# Altium project PCB_Project.PrjPcb
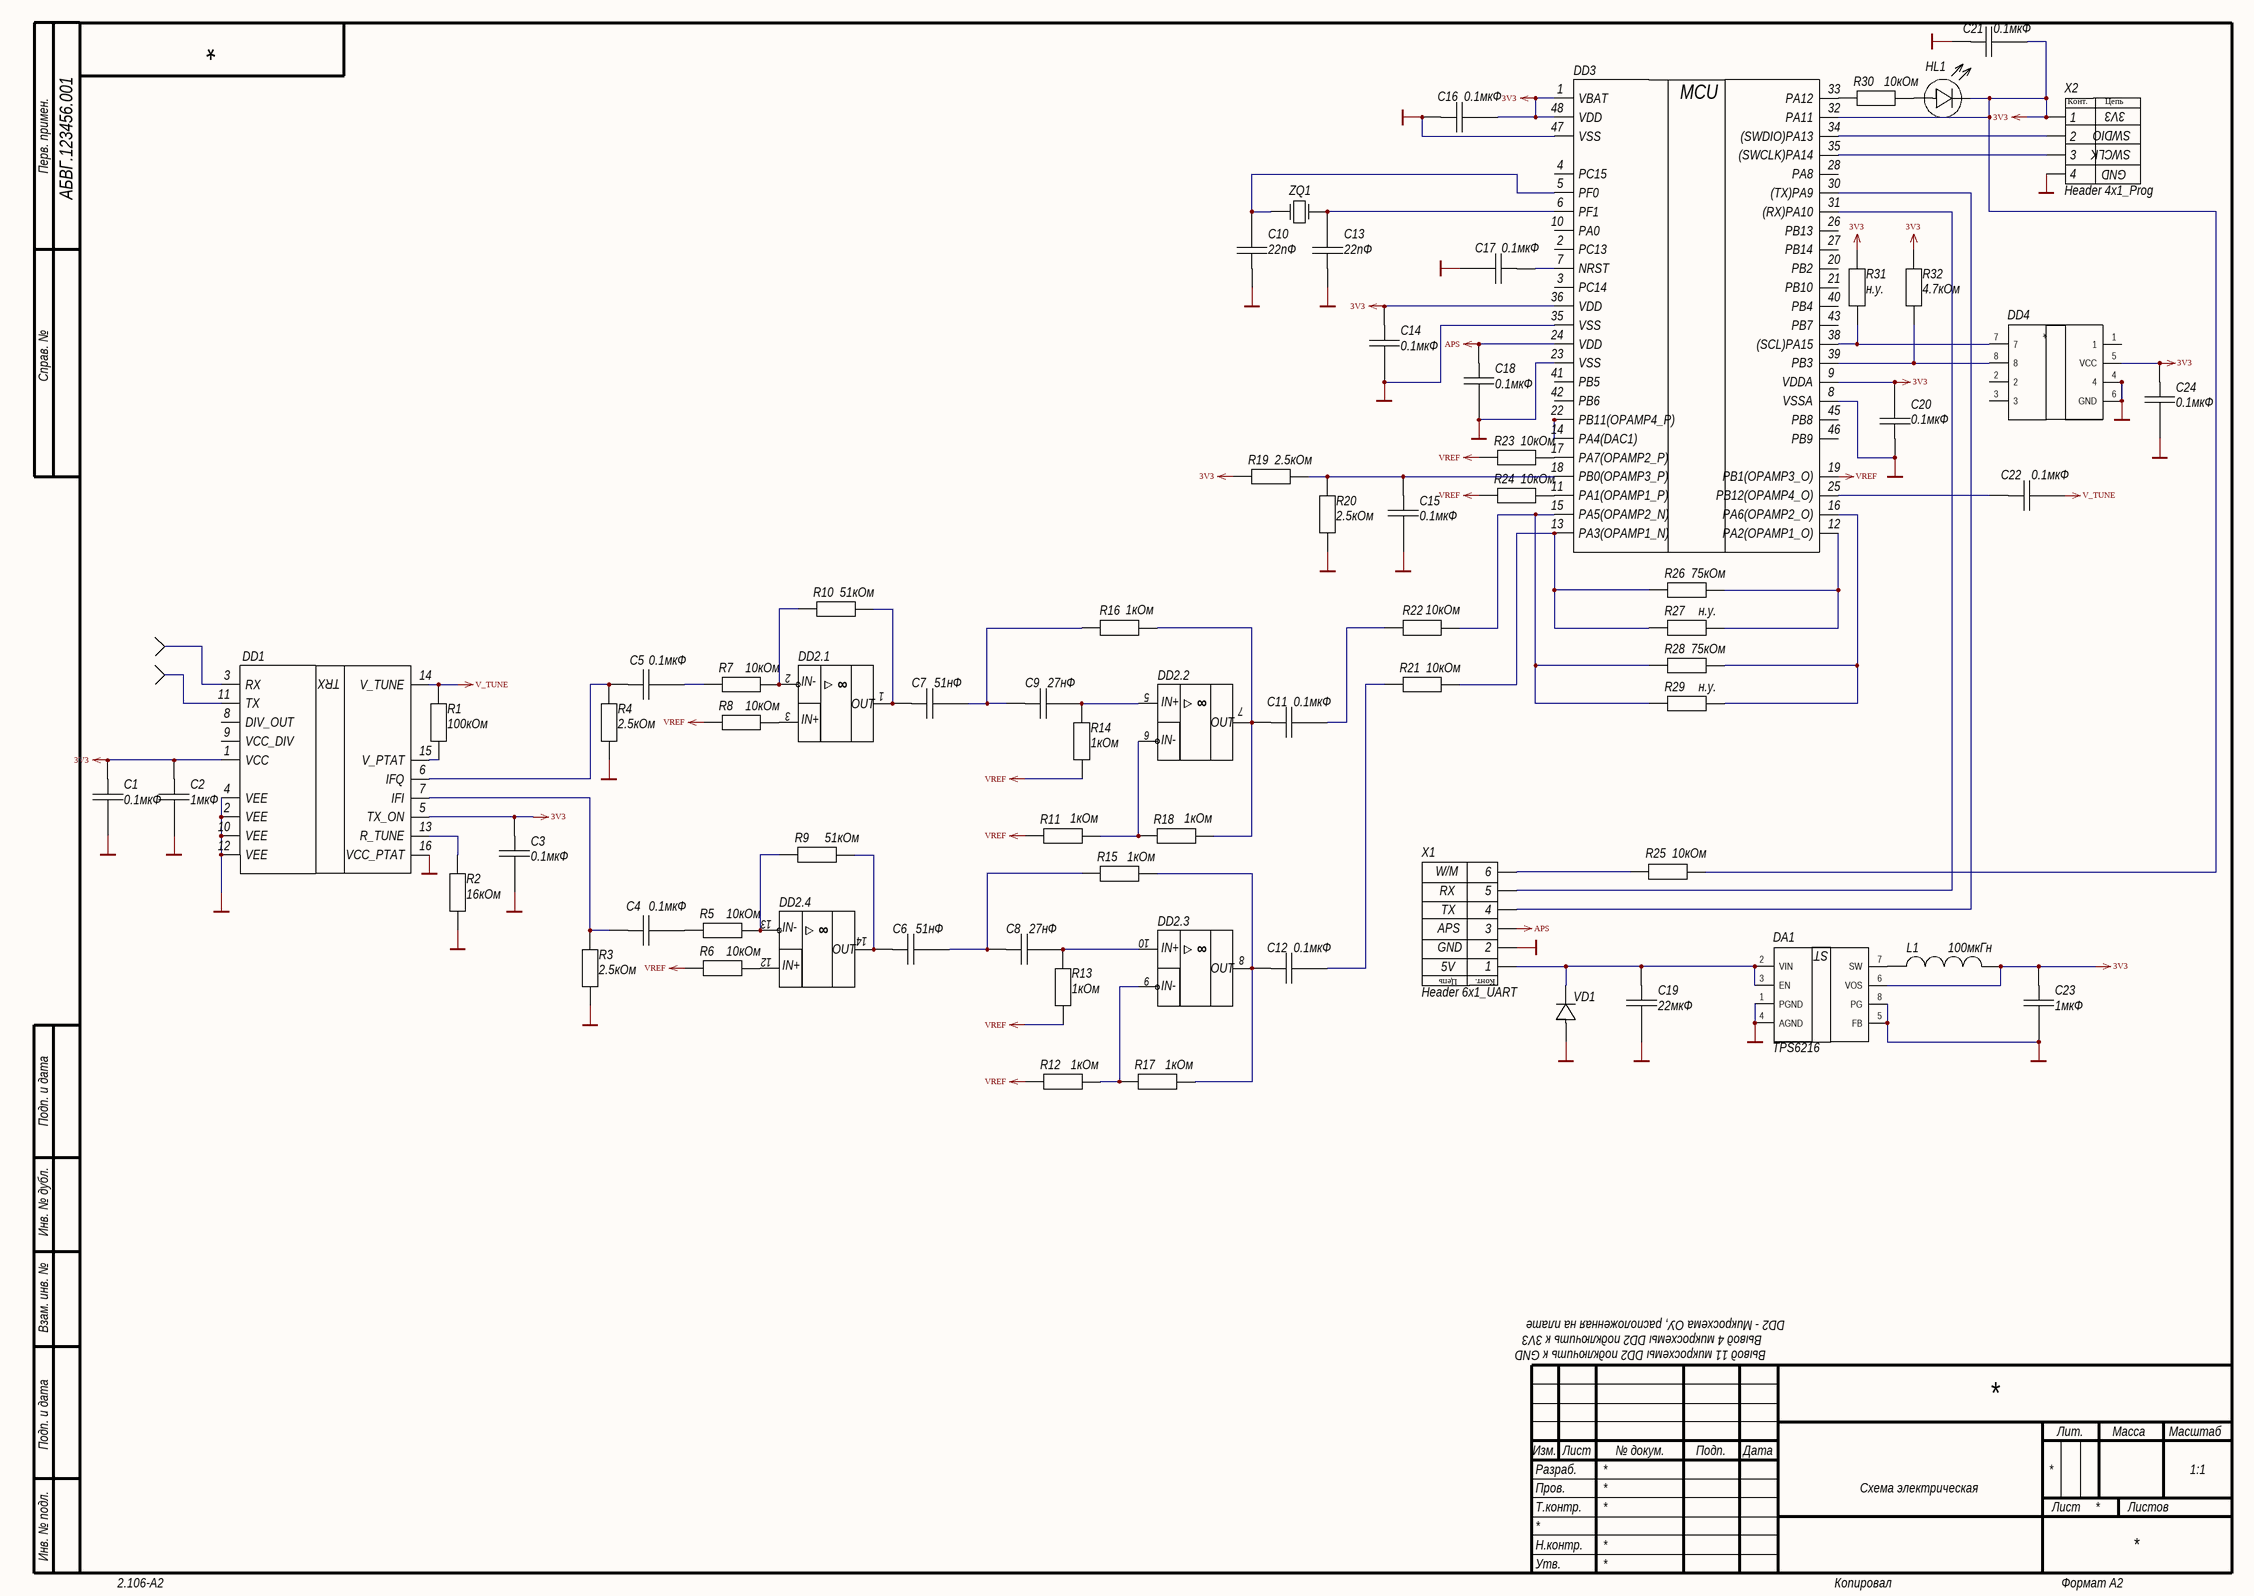
[diagram p0: Schematic.SchDoc]
1 sheet, 70 parts. Net scope: global (net labels, ports and power ports of the same name join across sheets).

## Sheet Schematic.SchDoc
size 594 x 420 mm; Scale: 1:1; DocumentType: Схема электрическая; FirstReferrence: АБВГ.123456.001; PageSetup: Record=PageOptions|CenterHorizontal=True|CenterVertical=True|PrintScale=0.70|XCorrection=1.00|YCorrection=1.00|PrintKind=0|BorderSize=5000000|LeftOffset=0|BottomOffset=0|Orientation=2|PaperLength=1000|PaperWidth=1000|Scale=100|PaperSource=7|PrintQuality=-3|MediaType=1|DitherType=10|PrintScaleMode=0|PaperKind=A3|PaperIndex=8

### Parts
C1  0.1мкФ  [0805_CAP]
C2  1мкФ  [0805_CAP]
C3  0.1мкФ  [0805_CAP]
C4  0.1мкФ  [0805_CAP]
C5  0.1мкФ  [0805_CAP]
C6  51нФ  [0805_CAP]
C7  51нФ  [0805_CAP]
C8  27нФ  [0805_CAP]
C9  27нФ  [0805_CAP]
C10  22пФ  [0805_CAP]
C11  0.1мкФ  [0805_CAP]
C12  0.1мкФ  [0805_CAP]
C13  22пФ  [0805_CAP]
C14  0.1мкФ  [0805_CAP]
C15  0.1мкФ  [0805_CAP]
C16  0.1мкФ  [0805_CAP]
C17  0.1мкФ  [0805_CAP]
C18  0.1мкФ  [0805_CAP]
C19  22мкФ  [0805_CAP]
C20  0.1мкФ  [0805_CAP]
C21  0.1мкФ  [0805_CAP]
C22  0.1мкФ  [0805_CAP]
C23  1мкФ  [0805_CAP]
C24  0.1мкФ  [0805_CAP]
DA1  TPS6216
DD1  Infineon  [ULN2803-SOP18]  (value not drawn)
DD2.1  operational amplifier  (value not drawn)
DD2.2  operational amplifier_1  (value not drawn)
DD2.3  operational amplifier_1  (value not drawn)
DD2.4  operational amplifier  (value not drawn)
DD3  STM32F303  [ATtiny2313-SOP20]  (value not drawn)
DD4  Flash_mb  (value not drawn)
HL1  LED  (value not drawn)
L1  100мкГн  [0603_IND]
R1  100кОм  [0805_RES]
R2  16кОм  [0805_RES]
R3  2.5кОм  [0805_RES]
R4  2.5кОм  [0805_RES]
R5  10кОм  [0805_RES]
R6  10кОм  [0805_RES]
R7  10кОм  [0805_RES]
R8  10кОм  [0805_RES]
R9  51кОм  [0805_RES]
R10  51кОм  [0805_RES]
R11  1кОм  [0805_RES]
R12  1кОм  [0805_RES]
R13  1кОм  [0805_RES]
R14  1кОм  [0805_RES]
R15  1кОм  [0805_RES]
R16  1кОм  [0805_RES]
R17  1кОм  [0805_RES]
R18  1кОм  [0805_RES]
R19  2.5кОм  [0805_RES]
R20  2.5кОм  [0805_RES]
R21  10кОм  [0805_RES]
R22  10кОм  [0805_RES]
R23  10кОм  [0805_RES]
R24  10кОм  [0805_RES]
R25  10кОм  [0805_RES]
R26  75кОм  [0805_RES]
R27  н.у.  [0805_RES]
R28  75кОм  [0805_RES]
R29  н.у.  [0805_RES]
R30  10кОм  [0805_RES]
R31  н.у.  [0805_RES]
R32  4.7кОм  [0805_RES]
VD1  diode  (value not drawn)
X1  Header 6x1_UART  [PBS-6]
X2  Header 4x1_Prog  [PBS-6]
ZQ1  (no value)  [Quartz]

### Nets
3V3: C1.2 C2.2 C3.2 C14.2 C16.1 C20.1 C21.1 C23.2 C24.2 DA1.6(VOS) DD1.1(VCC) DD1.5(TX_ON) DD3.1(VBAT) DD3.9(VDDA) DD3.32(PA11) DD3.36(VDD) DD3.48(VDD) DD4.5(VCC) HL1.11 L1.2 R19.1 R25.2 R31.1 R32.1 X2.1
APS: C18.2 DD3.24(VDD) X1.3
GND: C1.1 C2.1 C3.1 C10.2 C13.2 C14.1 C15.1 C16.2 C17.1 C18.1 C19.1 C20.2 C21.2 C23.1 C24.1 DA1.1(PGND) DA1.4(AGND) DA1.5(FB) DA1.8(PG) DD1.2(VEE) DD1.4(VEE) DD1.10(VEE) DD1.12(VEE) DD1.16(VCC_PTAT) DD3.8(VSSA) DD3.23(VSS) DD3.35(VSS) DD3.47(VSS) DD4.4 DD4.6(GND) R2.2 R3.2 R4.2 R20.2 VD1.10 X1.2 X2.4
V_TUNE: C22.1 DD1.14(V_TUNE) R1.1
VREF: DD3.19(PB1(OPAMP3_O)) R6.1 R8.1 R11.1 R12.1 R13.1 R14.1 R23.2 R24.2
NetC4_1: C4.1 R5.2
NetC4_2: C4.2 DD1.7(IFI) R3.1
NetC5_1: C5.1 R7.2
NetC5_2: C5.2 DD1.6(IFQ) R4.1
NetC6_1: C6.1 C8.2 R15.2
NetC6_2: C6.2 DD2.4.9 R9.1
NetC7_1: C7.1 C9.2 R16.2
NetC7_2: C7.2 DD2.1.9 R10.1
NetC8_1: C8.1 DD2.3.7 R13.2
NetC9_1: C9.1 DD2.2.7 R14.2
NetC10_1: C10.1 DD3.5(PF0) ZQ1.2
NetC11_1: C11.1 R22.1
NetC11_2: C11.2 DD2.2.9 R16.1 R18.2
NetC12_1: C12.1 R21.2
NetC12_2: C12.2 DD2.3.9 R15.1 R17.2
NetC13_1: C13.1 DD3.6(PF1) ZQ1.1
NetC15_2: C15.2 DD3.18(PB0(OPAMP3_P)) R19.2 R20.1
NetC17_2: C17.2 DD3.7(NRST)
NetC19_2: C19.2 DA1.2(VIN) DA1.3(EN) VD1.11 X1.1
NetC22_2: C22.2 DD3.25(PB12(OPAMP4_O))
NetDA1_7: DA1.7(SW) L1.1
NetDD1_13: DD1.13(R_TUNE) R2.1
NetDD1_15: DD1.15(V_PTAT) R1.2
NetDD2.1_7: DD2.1.7 R7.1 R10.2
NetDD2.1_8: DD2.1.8 R8.2
NetDD2.2_8: DD2.2.8 R11.2 R18.1
NetDD2.3_8: DD2.3.8 R12.2 R17.1
NetDD2.4_7: DD2.4.7 R5.1 R9.2
NetDD2.4_8: DD2.4.8 R6.2
NetDD3_11: DD3.11(PA1(OPAMP1_P)) R24.1
NetDD3_12: DD3.12(PA2(OPAMP1_O)) R26.1 R27.1
NetDD3_13: DD3.13(PA3(OPAMP1_N)) R21.1 R26.2 R27.2
NetDD3_14: DD3.14(PA4(DAC1)) DD3.22(PB11(OPAMP4_P))
NetDD3_15: DD3.15(PA5(OPAMP2_N)) R22.2 R28.2 R29.2
NetDD3_16: DD3.16(PA6(OPAMP2_O)) R28.1 R29.1
NetDD3_17: DD3.17(PA7(OPAMP2_P)) R23.1
NetDD3_30: DD3.30((TX)PA9) X1.4
NetDD3_31: DD3.31((RX)PA10) X1.5
NetDD3_33: DD3.33(PA12) R30.1
NetDD3_34: DD3.34((SWDIO)PA13) X2.2
NetDD3_35: DD3.35((SWCLK)PA14) X2.3
NetDD3_38: DD3.38((SCL)PA15) DD4.7 R31.2
NetDD3_39: DD3.39(PB3) DD4.8 R32.2
NetHL1_10: HL1.10 R30.2
NetR25_1: R25.1 X1.6

Not connected (* = marked no-connect by the designer): DD1 3(RX) 8(DIV_OUT) 9(VCC_DIV) 11(TX); DD3 2(PC13) 3(PC14) 4(PC15) 10(PA0) 20(PB2) 21(PB10) 26(PB13) 27(PB14) 28(PA8) 40(PB4) 41(PB5) 42(PB6) 43(PB7) 45(PB8) 46(PB9); DD4 1 2 3

### Notes on the sheet
- (near DD2.1) 2
- (near DD2.1) 1
- (near DD2.2) 5
- (near DD2.1) 3
- (near DD2.2) 6
- (near DD2.2) 7
- (near DD2.4) 13
- (near DD2.4) 14
- (near DD2.3) 10
- (near DD2.4) 12
- (near DD2.3) 9
- (near DD2.3) 8
- DD2 - Микросхема ОУ, расположенная на плате
- Вывод 4 микросхемы DD2 подключить к 3V3
- Вывод 11 микросхемы DD2 подключить к GND
- Перв. примен.
- Справ. №
- Подп. и дата
- Инв. № дубл.
- Взам. инв. №
- Разраб.
- Изм.
- Лист
- № докум.
- Подп.
- Дата
- Лит.
- Масса
- Масштаб
- Пров.
- Т.контр.
- Листов
- Инв. № подл.
- Утв.
- Н.контр.
- 2.106-A2
- Копировал
- Формат А2
- (in symbol Header 4x1_Prog) Конт.; Цепь; 3V3; SWDIO; SWCLK; GND
- (in symbol Header 6x1_UART) W/M; RX; TX; APS; GND; 5V; Цепь; Конт.
- (in symbol Infineon) TRX
- (in symbol operational amplifier) ∞; IN-; OUT; IN+
- (in symbol operational amplifier_1) ∞; IN+; OUT; IN-
- (in symbol STM32F303) MCU
- (in symbol TPS6216) ST

### Library data of the parts
C1-C24 = Capacitor: ValueType: Конденсатор; Tolerance: *; Dielectric: *; Voltage: *; ESR: *; URL: *; Temp: *; Power: *; Case: *; ValueManufacturer: *; ValueManufacturerPartNumber: *; ValueDescription: *
  C1 C3-C5 C11 C12 C14-C18 C20-C22 C24: Value: 0.1мкФ
  C2 C23: Value: 1мкФ
  C6 C7: Value: 51нФ
  C8 C9: Value: 27нФ
  C10 C13: Value: 22пФ
  C19: Value: 22мкФ
DD3 = STM32F303: ValueManufacture: ATMEGA; ValueDescription: Микроконтроллер; Case: soic-20(0.295 inch); ValueType: Микроконтроллер; ValueManufacturePartNumber: STM32F303
L1 = Inductor: ValueType: Индуктивность; Value: 100мкГн; Tolerance: *; Dielectric: *; ESR: *; URL: *; Temp: *; Power: *; Case: *; ValueManufacturer: *; ValueManufacturerPartNumber: *; ValueDescription: *
R1-R32 = Resistor: ValueType: Резистор; Tolerance: *; URL: *; Temp: *; Power: *; Case: *; ValueManufacturerPartNumber: *; ValueDescription: *
  R1: Value: 100кОм
  R2: Value: 16кОм
  R3 R4 R19 R20: Value: 2.5кОм
  R5-R8 R21-R25 R30: Value: 10кОм
  R9 R10: Value: 51кОм
  R11-R18: Value: 1кОм
  R26 R28: Value: 75кОм
  R27 R29 R31: Value: н.у.
  R32: Value: 4.7кОм
X1 = Header 6x1_UART: ValueType: Разъем; URL: *; TEMP: *; Case: PB5-6
X2 = Header 4x1_Prog: ValueType: Разъем; URL: *; TEMP: *; Case: PB5-6
ZQ1 = Quartz: ValueType: Кварцевый резонатор; ValueManufacturer: *; ValueManufacturerPartNumber: *; ValueDescription: *